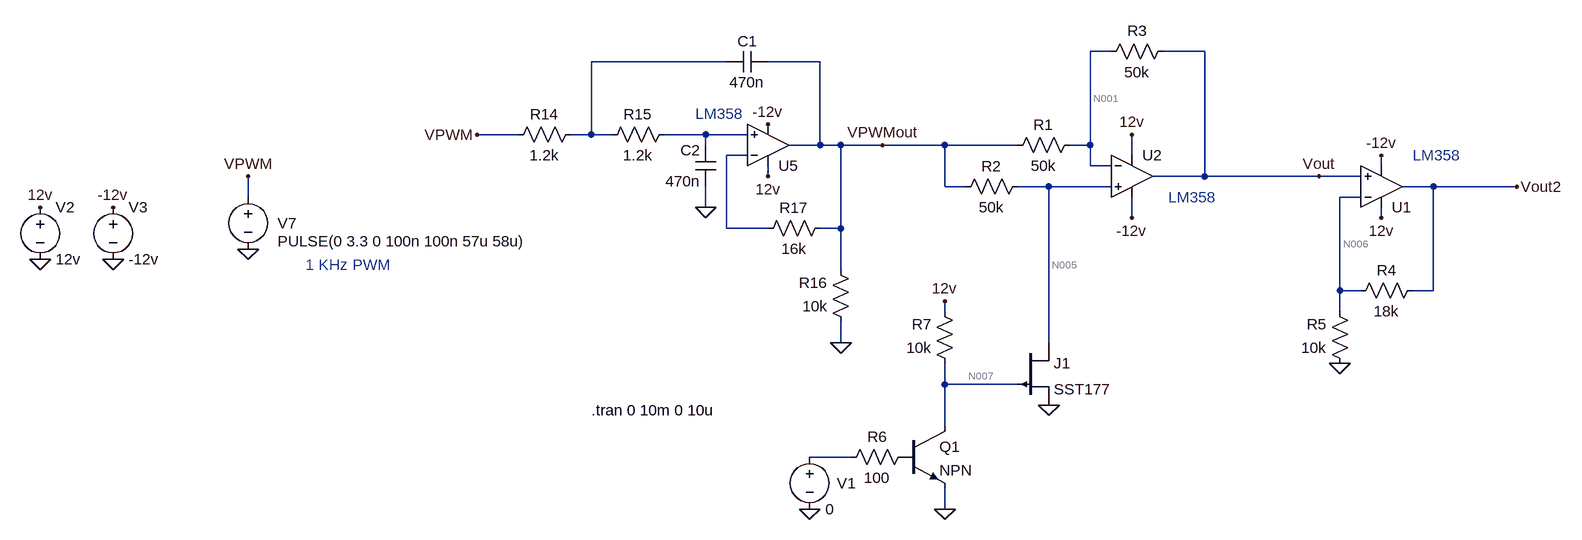
[diagram p0: schematic opamp_cir_pwm.asc]
opamp_cir_pwm.asc, the LTspice schematic file:
Version 4
SHEET 1 880 680
WIRE -1760 -1088 -1792 -1088
WIRE -1616 -1088 -1680 -1088
WIRE -2352 -1072 -2560 -1072
WIRE -2208 -1072 -2288 -1072
WIRE -2672 -960 -2736 -960
WIRE -2560 -960 -2560 -1072
WIRE -2560 -960 -2592 -960
WIRE -2528 -960 -2560 -960
WIRE -2384 -960 -2448 -960
WIRE -2320 -960 -2384 -960
WIRE -2384 -944 -2384 -960
WIRE -2208 -944 -2208 -1072
WIRE -2208 -944 -2256 -944
WIRE -2176 -944 -2208 -944
WIRE -2112 -944 -2176 -944
WIRE -2016 -944 -2112 -944
WIRE -1904 -944 -2016 -944
WIRE -1792 -944 -1792 -1088
WIRE -1792 -944 -1824 -944
WIRE -2320 -928 -2352 -928
WIRE -1728 -928 -1728 -960
WIRE -1792 -912 -1792 -944
WIRE -1760 -912 -1792 -912
WIRE -1344 -912 -1344 -928
WIRE -2288 -896 -2288 -912
WIRE -1616 -896 -1616 -1088
WIRE -1616 -896 -1696 -896
WIRE -1440 -896 -1616 -896
WIRE -1376 -896 -1440 -896
WIRE -2016 -880 -2016 -944
WIRE -1984 -880 -2016 -880
WIRE -1856 -880 -1904 -880
WIRE -1760 -880 -1856 -880
WIRE -1264 -880 -1312 -880
WIRE -1136 -880 -1264 -880
WIRE -3088 -864 -3088 -896
WIRE -1376 -864 -1408 -864
WIRE -2384 -848 -2384 -880
WIRE -1728 -832 -1728 -864
WIRE -1344 -832 -1344 -848
WIRE -2352 -816 -2352 -928
WIRE -2288 -816 -2352 -816
WIRE -2176 -816 -2176 -944
WIRE -2176 -816 -2208 -816
WIRE -2176 -752 -2176 -816
WIRE -1408 -720 -1408 -864
WIRE -1376 -720 -1408 -720
WIRE -1264 -720 -1264 -880
WIRE -1264 -720 -1296 -720
WIRE -2016 -688 -2016 -704
WIRE -1408 -688 -1408 -720
WIRE -2176 -640 -2176 -672
WIRE -1856 -640 -1856 -880
WIRE -2016 -576 -2016 -608
WIRE -1904 -576 -2016 -576
WIRE -2016 -512 -2016 -576
WIRE -2160 -464 -2224 -464
WIRE -2016 -384 -2016 -416
FLAG -3296 -768 0
FLAG -3408 -768 0
FLAG -3408 -848 12v
FLAG -3296 -848 -12v
FLAG -3088 -784 0
FLAG -3088 -896 VPWM
FLAG -2736 -960 VPWM
FLAG -2288 -896 12v
FLAG -2288 -976 -12v
FLAG -2384 -848 0
FLAG -2176 -640 0
FLAG -2112 -944 VPWMout
FLAG -1728 -960 12v
FLAG -1728 -832 -12v
FLAG -1440 -896 Vout
FLAG -1856 -544 0
FLAG -2224 -384 0
FLAG -1344 -832 12v
FLAG -1344 -928 -12v
FLAG -1408 -608 0
FLAG -1136 -880 Vout2
FLAG -2016 -384 0
FLAG -2016 -704 12v
SYMBOL voltage -3408 -864 R0
WINDOW 123 0 0 Left 0
WINDOW 39 0 0 Left 0
SYMATTR InstName V2
SYMATTR Value 12v
SYMBOL voltage -3296 -864 R0
WINDOW 123 0 0 Left 0
WINDOW 39 0 0 Left 0
SYMATTR InstName V3
SYMATTR Value -12v
SYMBOL voltage -3088 -880 R0
WINDOW 0 45 56 Left 2
WINDOW 3 45 84 Left 2
WINDOW 123 0 0 Left 0
WINDOW 39 0 0 Left 0
SYMATTR InstName V7
SYMATTR Value PULSE(0 3.3 0 100n 100n 57u 58u)
SYMBOL res -2576 -976 R90
WINDOW 0 0 56 VBottom 2
WINDOW 3 32 56 VTop 2
SYMATTR InstName R14
SYMATTR Value 1.2k
SYMBOL res -2432 -976 R90
WINDOW 0 0 56 VBottom 2
WINDOW 3 32 56 VTop 2
SYMATTR InstName R15
SYMATTR Value 1.2k
SYMBOL res -2160 -656 R180
WINDOW 0 36 76 Left 2
WINDOW 3 36 40 Left 2
SYMATTR InstName R16
SYMATTR Value 10k
SYMBOL res -2304 -800 R270
WINDOW 0 32 56 VTop 2
WINDOW 3 0 56 VBottom 2
SYMATTR InstName R17
SYMATTR Value 16k
SYMBOL cap -2288 -1088 R90
WINDOW 0 0 32 VBottom 2
WINDOW 3 32 32 VTop 2
SYMATTR InstName C1
SYMATTR Value 470n
SYMBOL cap -2368 -880 R180
WINDOW 0 24 56 Left 2
WINDOW 3 24 8 Left 2
SYMATTR InstName C2
SYMATTR Value 470n
SYMBOL Opamps\\UniversalOpamp2 -2288 -944 M180
SYMATTR InstName U5
SYMBOL Opamps\\UniversalOpamp2 -1728 -896 R0
SYMATTR InstName U2
SYMBOL res -1808 -960 R90
WINDOW 0 0 56 VBottom 2
WINDOW 3 32 56 VTop 2
SYMATTR InstName R1
SYMATTR Value 50k
SYMBOL res -1664 -1104 R90
WINDOW 0 0 56 VBottom 2
WINDOW 3 32 56 VTop 2
SYMATTR InstName R3
SYMATTR Value 50k
SYMBOL pjf -1904 -640 R0
SYMATTR InstName J1
SYMATTR Value SST177
SYMBOL res -1888 -896 R90
WINDOW 0 0 56 VBottom 2
WINDOW 3 32 56 VTop 2
SYMATTR InstName R2
SYMATTR Value 50k
SYMBOL voltage -2224 -480 R0
WINDOW 123 0 0 Left 0
WINDOW 39 0 0 Left 0
WINDOW 0 42 56 Left 2
SYMATTR InstName V1
SYMATTR Value 0
SYMBOL Opamps\\UniversalOpamp2 -1344 -880 M180
SYMATTR InstName U1
SYMBOL res -1280 -736 R90
WINDOW 0 0 56 VBottom 2
WINDOW 3 32 56 VTop 2
SYMATTR InstName R4
SYMATTR Value 18k
SYMBOL res -1392 -592 R180
WINDOW 0 36 76 Left 2
WINDOW 3 36 40 Left 2
SYMATTR InstName R5
SYMATTR Value 10k
SYMBOL npn -2080 -512 R0
SYMATTR InstName Q1
SYMBOL res -2064 -480 R90
WINDOW 0 0 56 VBottom 2
WINDOW 3 32 56 VTop 2
SYMATTR InstName R6
SYMATTR Value 100
SYMBOL res -2000 -592 R180
WINDOW 0 36 76 Left 2
WINDOW 3 36 40 Left 2
SYMATTR InstName R7
SYMATTR Value 10k
TEXT -3000 -760 Left 2 ;1 KHz PWM
TEXT -2560 -536 Left 2 !.tran 0 10m 0 10u
TEXT -1672 -864 Left 2 ;LM358
TEXT -2400 -992 Left 2 ;LM358
TEXT -1296 -928 Left 2 ;LM358

The netlist it stands for:
* opamp_cir_pwm.asc
V2 12v 0 12v
V3 -12v 0 -12v
V7 VPWM 0 PULSE(0 3.3 0 100n 100n 57u 58u)
R14 N002 VPWM 1.2k
R15 N003 N002 1.2k
R16 0 VPWMout 10k
R17 N004 VPWMout 16k
C1 VPWMout N002 470n
C2 0 N003 470n
XU5 N003 N004 12v -12v VPWMout level.2 Avol=1Meg GBW=10Meg Slew=10Meg ilimit=25m rail=0 Vos=0 phimargin=45 en=0 enk=0 in=0 ink=0 Rin=500Meg  ; pins IN+ IN- V+ V- OUT
XU2 N005 N001 12v -12v Vout level.2 Avol=1Meg GBW=10Meg Slew=10Meg ilimit=25m rail=0 Vos=0 phimargin=45 en=0 enk=0 in=0 ink=0 Rin=500Meg  ; pins IN+ IN- V+ V- OUT
R1 N001 VPWMout 50k
R3 Vout N001 50k
J1 N005 N007 0 SST177
R2 N005 VPWMout 50k
V1 N008 0 0
XU1 Vout N006 12v -12v Vout2 level.2 Avol=1Meg GBW=10Meg Slew=10Meg ilimit=25m rail=0 Vos=0 phimargin=45 en=0 enk=0 in=0 ink=0 Rin=500Meg  ; pins IN+ IN- V+ V- OUT
R4 Vout2 N006 18k
R5 0 N006 10k
Q1 N007 P001 0 0 NPN
R6 P001 N008 100
R7 N007 12v 10k
.model NPN NPN
.model PNP PNP
.lib standard.bjt
.model NJF NJF
.model PJF PJF
.lib standard.jft
* 1 KHz PWM
.tran 0 10m 0 10u
* LM358
* LM358
* LM358
.lib UniversalOpamps2.sub
.backanno
.end

* Results of the author's LTspice run, read from the files saved beside the schematic
* Operating Point, zero values left out:
*   V(12v) = 12 V
*   V(-12v) = -12 V
*   V(vout) = 2.146 µV
*   V(n001) = 1.073 µV
*   V(n005) = 1.073 µV
*   V(n007) = 12 V
*   V(vout2) = 6.01 µV
*   V(n006) = 2.146 µV
*   Ic(Q1) = 12 pA
*   Ib(Q1) = -12 pA
*   Id(J1) = -21.47 pA
*   Ig(J1) = 42.93 pA
*   Is(J1) = -21.47 pA
*   I(R7) = -54.93 pA
*   I(R6) = 12 pA
*   I(R5) = -214.6 pA
*   I(R4) = 214.6 pA
*   I(R2) = 21.46 pA
*   I(R3) = 21.47 pA
*   I(R1) = 21.46 pA
*   I(V1) = 12 pA
*   I(V3) = 3.597 mA
*   I(V2) = -3.597 mA
*   Ix(u5:3) = 1.199 mA
*   Ix(u5:4) = -1.199 mA
*   Ix(u5:5) = 42.93 pA
*   Ix(u2:3) = 1.199 mA
*   Ix(u2:4) = -1.199 mA
*   Ix(u2:5) = -21.47 pA
*   Ix(u1:3) = 1.199 mA
*   Ix(u1:4) = -1.199 mA
*   Ix(u1:5) = -214.6 pA
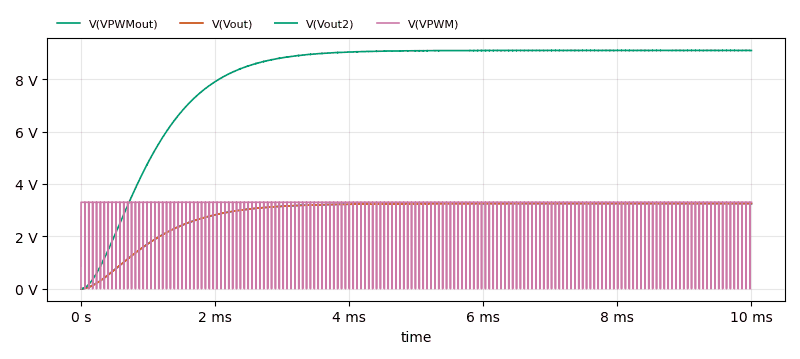
[diagram p1: Transient Analysis of opamp_cir_pwm.asc, plotted from the saved traces]
* Transient Analysis, 1 run:
*   V(VPWMout): min 0 V, max 3.253 V, average 2.883 V, rms 2.986 V, last 3.249 V
*   V(Vout): min -1.411 mV, max 3.25 V, average 2.882 V, rms 2.986 V, last 3.249 V
*   V(Vout2): min -2.68 mV, max 9.099 V, average 8.07 V, rms 8.361 V, last 9.096 V
*   V(VPWM): min 0 V, max 3.3 V, average 3.249 V, rms 3.273 V, last 3.3 V